# EAGLE schematic parport (EAGLE 7.7.0)
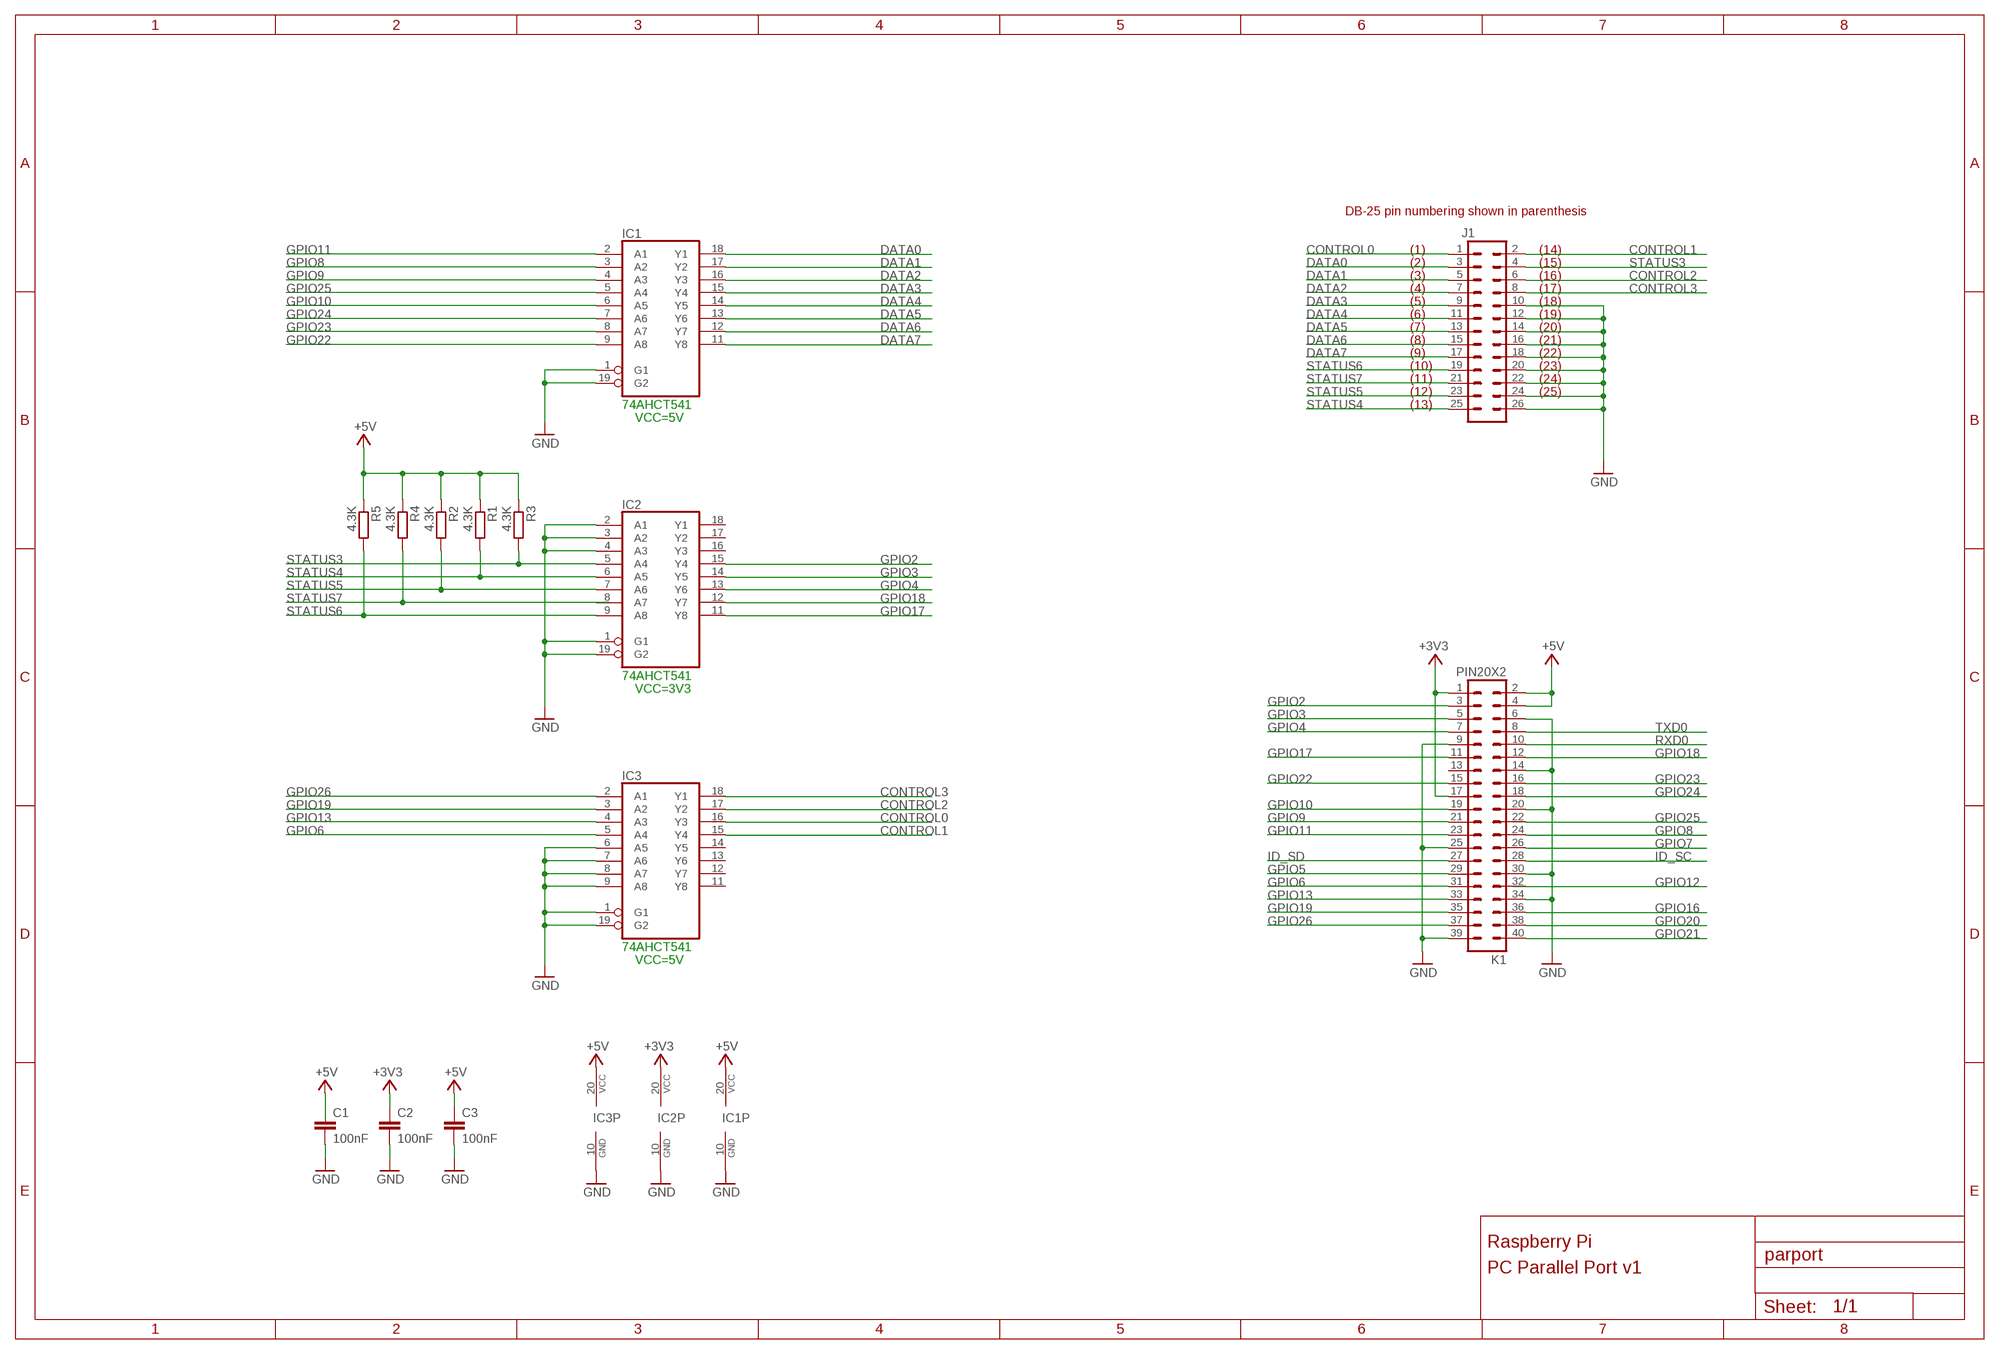
[diagram p0: schematic, sheet 1]

## Parts
C1  100nF  C-EUC0805  [C0805]
C2  100nF  C-EUC0805  [C0805]
C3  100nF  C-EUC0805  [C0805]
IC1  74LS541DW  [SO20W]
IC2  74LS541DW  [SO20W]
IC3  74LS541DW  [SO20W]
J1  M13X22X13  [2X13]
K1  PIN20X2  [PIN_20X2]
R1  4.3K  R-EU_R0805  [R0805]
R2  4.3K  R-EU_R0805  [R0805]
R3  4.3K  R-EU_R0805  [R0805]
R4  4.3K  R-EU_R0805  [R0805]
R5  4.3K  R-EU_R0805  [R0805]

## Nets
+3V3: C2.1 IC2.20(VCC) K1.1 K1.17
+5V: C1.1 C3.1 IC1.20(VCC) IC3.20(VCC) K1.2 K1.4 R1.1 R2.1 R3.1 R4.1 R5.1
CONTROL0: IC3.16(Y3) J1.1
CONTROL1: IC3.15(Y4) J1.2
CONTROL2: IC3.17(Y2) J1.6
CONTROL3: IC3.18(Y1) J1.8
DATA0: IC1.18(Y1) J1.3
DATA1: IC1.17(Y2) J1.5
DATA2: IC1.16(Y3) J1.7
DATA3: IC1.15(Y4) J1.9
DATA4: IC1.14(Y5) J1.11
DATA5: IC1.13(Y6) J1.13
DATA6: IC1.12(Y7) J1.15
DATA7: IC1.11(Y8) J1.17
GND: C1.2 C2.2 C3.2 IC1.1(G1) IC1.10(GND) IC1.19(G2) IC2.1(G1) IC2.2(A1) IC2.3(A2) IC2.4(A3) IC2.10(GND) IC2.19(G2) IC3.1(G1) IC3.6(A5) IC3.7(A6) IC3.8(A7) IC3.9(A8) IC3.10(GND) IC3.19(G2) J1.10 J1.12 J1.14 J1.16 J1.18 J1.20 J1.22 J1.24 J1.26 K1.6 K1.9 K1.14 K1.20 K1.25 K1.30 K1.34 K1.39
GPIO2: IC2.15(Y4) K1.3
GPIO3: IC2.14(Y5) K1.5
GPIO4: IC2.13(Y6) K1.7
GPIO5: K1.29
GPIO6: IC3.5(A4) K1.31
GPIO7: K1.26
GPIO8: IC1.3(A2) K1.24
GPIO9: IC1.4(A3) K1.21
GPIO10: IC1.6(A5) K1.19
GPIO11: IC1.2(A1) K1.23
GPIO13: IC3.4(A3) K1.33
GPIO16: K1.36
GPIO17: IC2.11(Y8) K1.11
GPIO18: IC2.12(Y7) K1.12
GPIO19: IC3.3(A2) K1.35
GPIO20: K1.38
GPIO21: K1.40
GPIO22: IC1.9(A8) K1.15
GPIO23: IC1.8(A7) K1.16
GPIO24: IC1.7(A6) K1.18
GPIO25: IC1.5(A4) K1.22
GPIO26: IC3.2(A1) K1.37
ID_SC: K1.28
ID_SD: K1.27
RXD0: K1.10
STATUS3: IC2.5(A4) J1.4 R3.2
STATUS4: IC2.6(A5) J1.25 R1.2
STATUS5: IC2.7(A6) J1.23 R2.2
STATUS6: IC2.9(A8) J1.19 R5.2
STATUS7: IC2.8(A7) J1.21 R4.2
TXD0: K1.8
Unconnected: IC2.16(Y3) IC2.17(Y2) IC2.18(Y1) IC3.11(Y8) IC3.12(Y7) IC3.13(Y6) IC3.14(Y5) K1.13 K1.32

## Notes on the sheet
- DB-25 pin numbering shown in parenthesis
- (1) | (14)
- (2) | (15)
- (3) | (16)
- (4) | (17)
- (5) | (18)
- (6) | (19)
- (7) | (20)
- (8) | (21)
- (9) | (22)
- (10) | (23)
- (11) | (24)
- (12) | (25)
- 74AHCT541 | (13)
- VCC=5V
- 74AHCT541
- VCC=3V3
- 74AHCT541
- VCC=5V
- Raspberry Pi
- PC Parallel Port v1

## Library data of the parts
C1-C3 = resistor:C-EU: CAPACITOR, European symbol
IC1-IC3 = 74xx-us:74*541: Octal BUFFER and LINE DRIVER, 3-state
J1 = SparkFun-Connectors:M13X2: 0.1" spaced headers
K1 = FLYFISH:PIN20X2
R1-R5 = resistor:R-EU_: RESISTOR, European symbol